# Altium schematic sheet Expanders.SchDoc
size A2
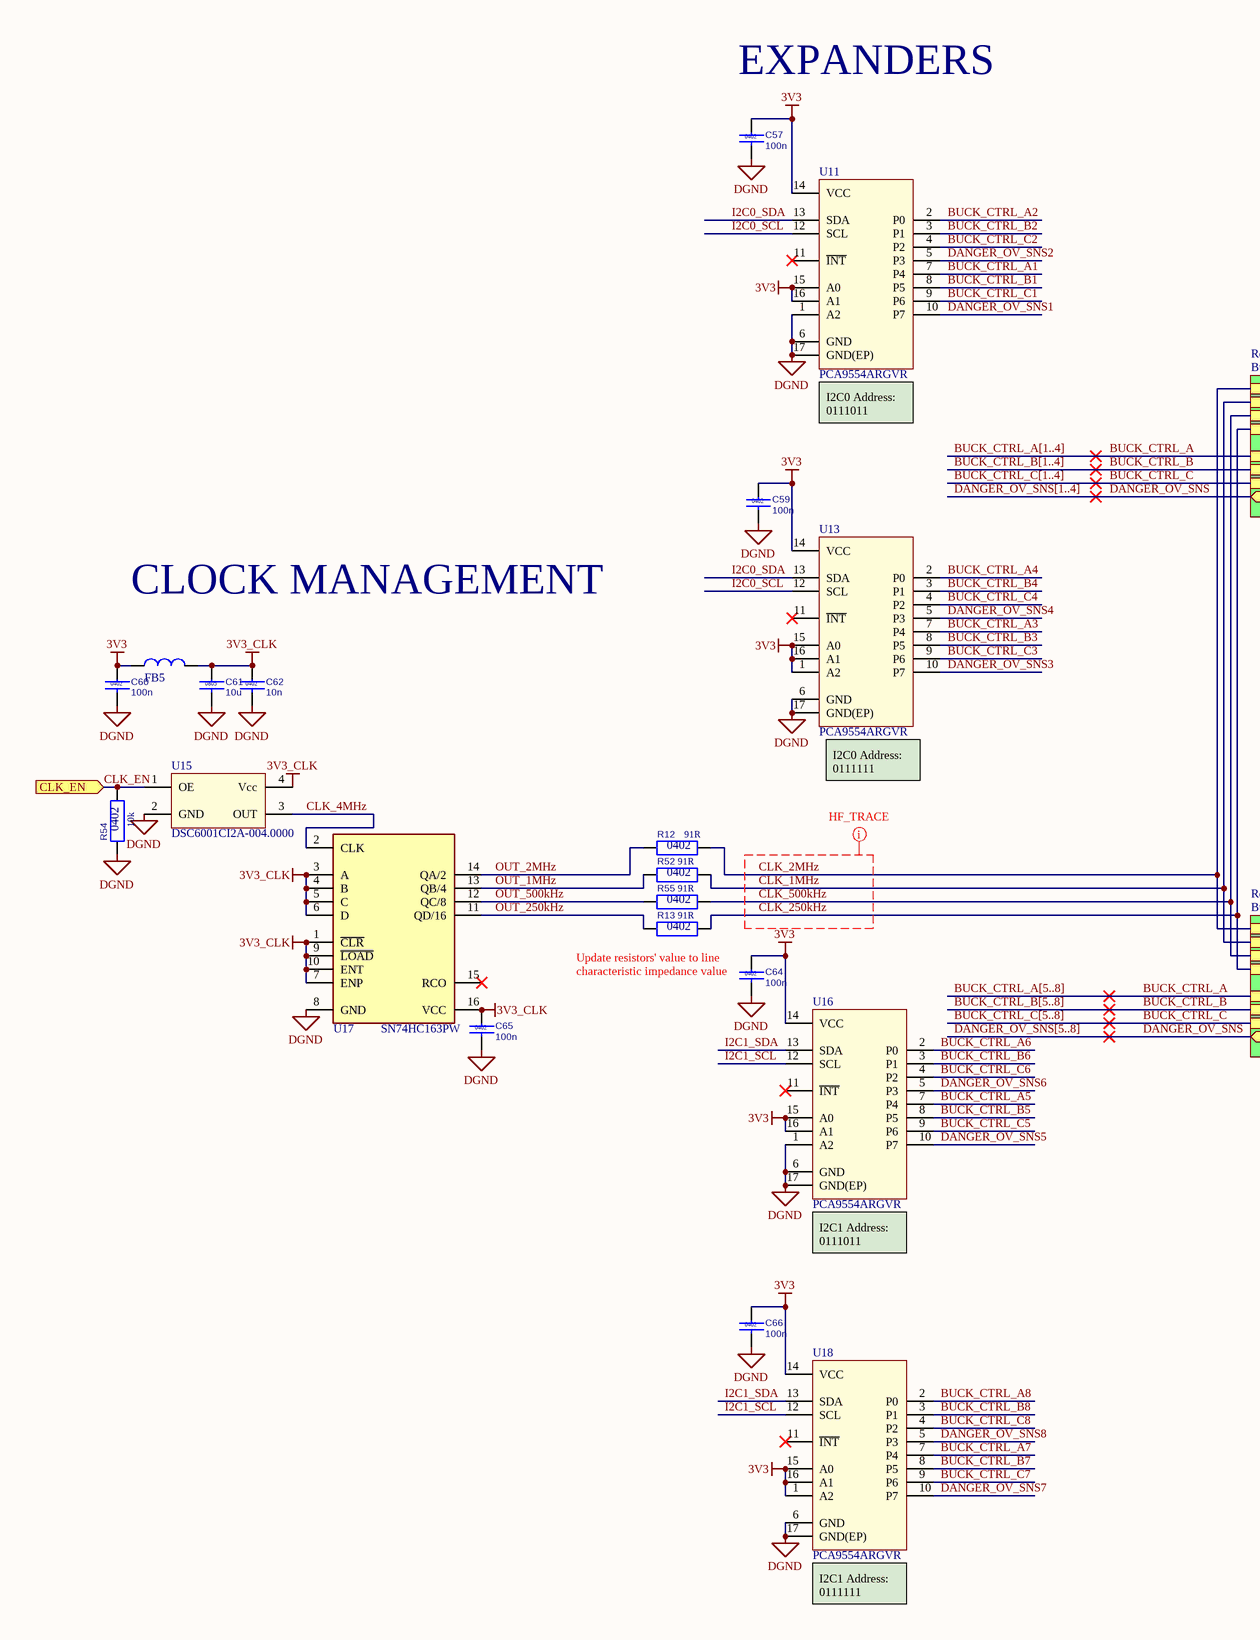
[diagram p0: Expanders.SchDoc, left]
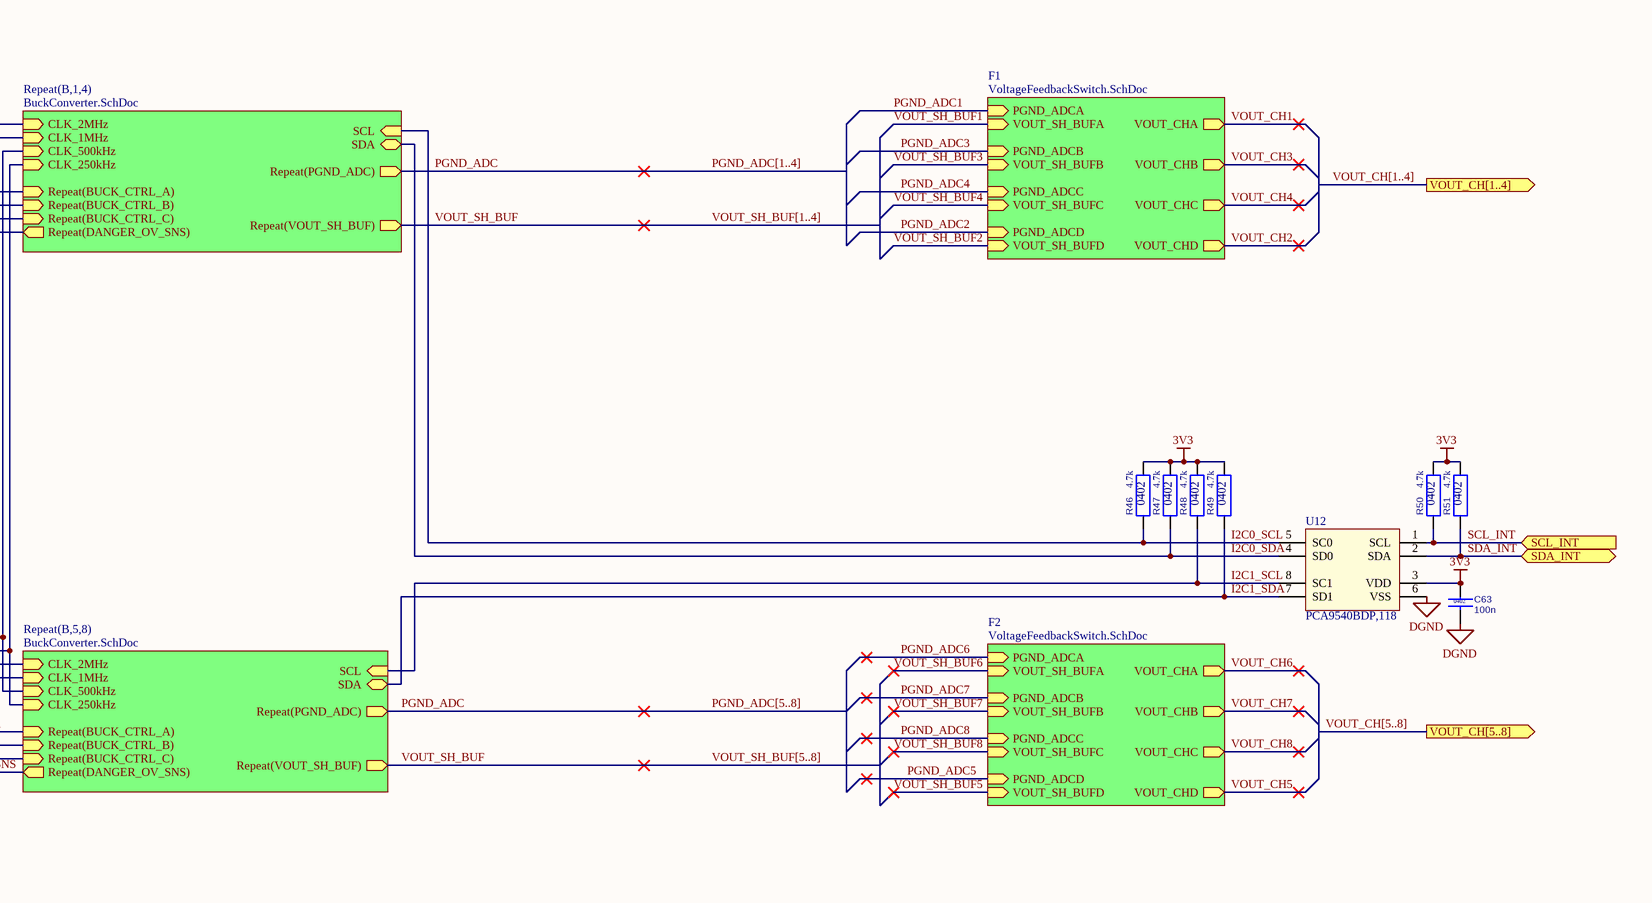
[diagram p1: Expanders.SchDoc, right]

## Parts
C57  100n  Case: 0402  [CC0402M]
C59  100n  Case: 0402  [CC0402M]
C60  100n  Case: 0402  [CC0402M]
C61  10u  Case: 0805  [CC0805M]
C62  10n  Case: 0402  [CC0402M]
C63  100n  Case: 0402  [CC0402M]
C64  100n  Case: 0402  [CC0402M]
C65  100n  Case: 0402  [CC0402M]
C66  100n  Case: 0402  [CC0402M]
FB5  BLM18HG102SN1D  [FB0603M]  (value not drawn)
R12  Case: 0402  [RC0402M]  (hidden comment: 91R)
R13  Case: 0402  [RC0402M]  (hidden comment: 91R)
R46  Case: 0402  [RC0402M]  (hidden comment: 4.7k)
R47  Case: 0402  [RC0402M]  (hidden comment: 4.7k)
R48  Case: 0402  [RC0402M]  (hidden comment: 4.7k)
R49  Case: 0402  [RC0402M]  (hidden comment: 4.7k)
R50  Case: 0402  [RC0402M]  (hidden comment: 4.7k)
R51  Case: 0402  [RC0402M]  (hidden comment: 4.7k)
R52  Case: 0402  [RC0402M]  (hidden comment: 91R)
R54  Case: 0402  [RC0402M]  (hidden comment: 10k)
R55  Case: 0402  [RC0402M]  (hidden comment: 91R)
U11  PCA9554ARGVR  [VQFN-16(RGV)]
U12  PCA9540BDP,118  [TSSOP-8]
U13  PCA9554ARGVR  [VQFN-16(RGV)]
U15  DSC6001CI2A-004.0000  [CDFN3225-4LD]
U16  PCA9554ARGVR  [VQFN-16(RGV)]
U17  SN74HC163PW  [TSSOP-16]
U18  PCA9554ARGVR  [VQFN-16(RGV)]

## Sub-sheets
F1 = VoltageFeedbackSwitch.SchDoc: PGND_ADCD (in), VOUT_SH_BUFD (in), PGND_ADCB (in), VOUT_SH_BUFB (in), VOUT_CHD (out), VOUT_SH_BUFC (in), PGND_ADCC (in), VOUT_CHA (out), PGND_ADCA (in), VOUT_SH_BUFA (in), VOUT_CHC (out), VOUT_CHB (out)
F2 = VoltageFeedbackSwitch.SchDoc: PGND_ADCD (in), VOUT_SH_BUFD (in), PGND_ADCB (in), VOUT_SH_BUFB (in), VOUT_CHD (out), VOUT_SH_BUFC (in), PGND_ADCC (in), VOUT_CHA (out), PGND_ADCA (in), VOUT_SH_BUFA (in), VOUT_CHC (out), VOUT_CHB (out)
Repeat(B,1,4) = BuckConverter.SchDoc: CLK_1MHz (in), SDA (bidir), SCL (in), CLK_500kHz (in), Repeat(BUCK_CTRL_C) (in), Repeat(BUCK_CTRL_B) (in), Repeat(BUCK_CTRL_A) (in), Repeat(DANGER_OV_SNS) (out), Repeat(PGND_ADC) (out), Repeat(VOUT_SH_BUF) (out), CLK_250kHz (in), CLK_2MHz (in)
Repeat(B,5,8) = BuckConverter.SchDoc: CLK_1MHz (in), SDA (bidir), SCL (in), CLK_500kHz (in), Repeat(BUCK_CTRL_C) (in), Repeat(BUCK_CTRL_B) (in), Repeat(BUCK_CTRL_A) (in), Repeat(DANGER_OV_SNS) (out), Repeat(PGND_ADC) (out), Repeat(VOUT_SH_BUF) (out), CLK_250kHz (in), CLK_2MHz (in)

## Ports
CLK_EN (in), SCL_INT (in), SDA_INT (bidir), VOUT_CH[1..4] (out), VOUT_CH[5..8] (out)

## Nets
3V3: C57.1 C59.1 C60.1 C63.1 C64.1 C66.1 FB5.1 R46.2 R47.2 R48.2 R49.2 R50.2 R51.2 U11.14(VCC) U11.15(A0) U11.16(A1) U12.3(VDD) U13.1(A2) U13.14(VCC) U13.15(A0) U13.16(A1) U16.14(VCC) U16.15(A0) U16.16(A1) U18.1(A2) U18.14(VCC) U18.15(A0) U18.16(A1)
3V3_CLK: C61.1 C62.1 C65.1 FB5.2 U15.4(Vcc) U17.1(~{CLR}) U17.3(A) U17.4(B) U17.5(C) U17.6(D) U17.7(ENP) U17.9(~{LOAD}) U17.10(ENT) U17.16(VCC)
DGND: C57.2 C59.2 C60.2 C61.2 C62.2 C63.2 C64.2 C65.2 C66.2 R54.1 U11.1(A2) U11.6(GND) U11.17(GND(EP)) U12.6(VSS) U13.6(GND) U13.17(GND(EP)) U15.2(GND) U16.1(A2) U16.6(GND) U16.17(GND(EP)) U17.8(GND) U18.6(GND) U18.17(GND(EP))
BUCK_CTRL_A: sheet Repeat(B,1,4)/Repeat(BUCK_CTRL_A), sheet Repeat(B,5,8)/Repeat(BUCK_CTRL_A)
BUCK_CTRL_A1: U11.7(P4)
BUCK_CTRL_A2: U11.2(P0)
BUCK_CTRL_A3: U13.7(P4)
BUCK_CTRL_A4: U13.2(P0)
BUCK_CTRL_A5: U16.7(P4)
BUCK_CTRL_A6: U16.2(P0)
BUCK_CTRL_A7: U18.7(P4)
BUCK_CTRL_A8: U18.2(P0)
BUCK_CTRL_B: sheet Repeat(B,1,4)/Repeat(BUCK_CTRL_B), sheet Repeat(B,5,8)/Repeat(BUCK_CTRL_B)
BUCK_CTRL_B1: U11.8(P5)
BUCK_CTRL_B2: U11.3(P1)
BUCK_CTRL_B3: U13.8(P5)
BUCK_CTRL_B4: U13.3(P1)
BUCK_CTRL_B5: U16.8(P5)
BUCK_CTRL_B6: U16.3(P1)
BUCK_CTRL_B7: U18.8(P5)
BUCK_CTRL_B8: U18.3(P1)
BUCK_CTRL_C: sheet Repeat(B,1,4)/Repeat(BUCK_CTRL_C), sheet Repeat(B,5,8)/Repeat(BUCK_CTRL_C)
BUCK_CTRL_C1: U11.9(P6)
BUCK_CTRL_C2: U11.4(P2)
BUCK_CTRL_C3: U13.9(P6)
BUCK_CTRL_C4: U13.4(P2)
BUCK_CTRL_C5: U16.9(P6)
BUCK_CTRL_C6: U16.4(P2)
BUCK_CTRL_C7: U18.9(P6)
BUCK_CTRL_C8: U18.4(P2)
CLK_1MHz: R52.2 ; sheet Repeat(B,1,4)/CLK_1MHz, sheet Repeat(B,5,8)/CLK_1MHz
CLK_2MHz: R12.2 ; sheet Repeat(B,1,4)/CLK_2MHz, sheet Repeat(B,5,8)/CLK_2MHz
CLK_4MHz: U15.3(OUT) U17.2(CLK)
CLK_250kHz: R13.2 ; sheet Repeat(B,1,4)/CLK_250kHz, sheet Repeat(B,5,8)/CLK_250kHz
CLK_500kHz: R55.2 ; sheet Repeat(B,1,4)/CLK_500kHz, sheet Repeat(B,5,8)/CLK_500kHz
CLK_EN: R54.2 U15.1(OE) ; port CLK_EN
DANGER_OV_SNS: sheet Repeat(B,1,4)/Repeat(DANGER_OV_SNS), sheet Repeat(B,5,8)/Repeat(DANGER_OV_SNS)
DANGER_OV_SNS1: U11.10(P7)
DANGER_OV_SNS2: U11.5(P3)
DANGER_OV_SNS3: U13.10(P7)
DANGER_OV_SNS4: U13.5(P3)
DANGER_OV_SNS5: U16.10(P7)
DANGER_OV_SNS6: U16.5(P3)
DANGER_OV_SNS7: U18.10(P7)
DANGER_OV_SNS8: U18.5(P3)
I2C0_SCL: R46.1 U11.12(SCL) U12.5(SC0) U13.12(SCL) ; sheet Repeat(B,1,4)/SCL
I2C0_SDA: R47.1 U11.13(SDA) U12.4(SD0) U13.13(SDA) ; sheet Repeat(B,1,4)/SDA
I2C1_SCL: R48.1 U12.8(SC1) U16.12(SCL) U18.12(SCL) ; sheet Repeat(B,5,8)/SCL
I2C1_SDA: R49.1 U12.7(SD1) U16.13(SDA) U18.13(SDA) ; sheet Repeat(B,5,8)/SDA
OUT_1MHz: R52.1 U17.13(QB/4)
OUT_2MHz: R12.1 U17.14(QA/2)
OUT_250kHz: R13.1 U17.11(QD/16)
OUT_500kHz: R55.1 U17.12(QC/8)
PGND_ADC: sheet Repeat(B,1,4)/Repeat(PGND_ADC), sheet Repeat(B,5,8)/Repeat(PGND_ADC)
PGND_ADC1: sheet F1/PGND_ADCA
PGND_ADC2: sheet F1/PGND_ADCD
PGND_ADC3: sheet F1/PGND_ADCB
PGND_ADC4: sheet F1/PGND_ADCC
PGND_ADC5: sheet F2/PGND_ADCD
PGND_ADC6: sheet F2/PGND_ADCA
PGND_ADC7: sheet F2/PGND_ADCB
PGND_ADC8: sheet F2/PGND_ADCC
SCL_INT: R50.1 U12.1(SCL) ; port SCL_INT
SDA_INT: R51.1 U12.2(SDA) ; port SDA_INT
VOUT_CH1: sheet F1/VOUT_CHA
VOUT_CH2: sheet F1/VOUT_CHD
VOUT_CH3: sheet F1/VOUT_CHB
VOUT_CH4: sheet F1/VOUT_CHC
VOUT_CH5: sheet F2/VOUT_CHD
VOUT_CH6: sheet F2/VOUT_CHA
VOUT_CH7: sheet F2/VOUT_CHB
VOUT_CH8: sheet F2/VOUT_CHC
VOUT_SH_BUF: sheet Repeat(B,1,4)/Repeat(VOUT_SH_BUF), sheet Repeat(B,5,8)/Repeat(VOUT_SH_BUF)
VOUT_SH_BUF1: sheet F1/VOUT_SH_BUFA
VOUT_SH_BUF2: sheet F1/VOUT_SH_BUFD
VOUT_SH_BUF3: sheet F1/VOUT_SH_BUFB
VOUT_SH_BUF4: sheet F1/VOUT_SH_BUFC
VOUT_SH_BUF5: sheet F2/VOUT_SH_BUFD
VOUT_SH_BUF6: sheet F2/VOUT_SH_BUFA
VOUT_SH_BUF7: sheet F2/VOUT_SH_BUFB
VOUT_SH_BUF8: sheet F2/VOUT_SH_BUFC

Not connected (* = marked no-connect by the designer): U11 11(~{INT})*; U13 11(~{INT})*; U16 11(~{INT})*; U17 15(RCO)*; U18 11(~{INT})*

## Buses and harness runs
bus BUCK_CTRL_A[1..4]
bus BUCK_CTRL_A[5..8]
bus BUCK_CTRL_B[1..4]
bus BUCK_CTRL_B[5..8]
bus BUCK_CTRL_C[1..4]
bus BUCK_CTRL_C[5..8]
bus DANGER_OV_SNS[1..4]
bus DANGER_OV_SNS[5..8]
bus PGND_ADC[1..4]
bus PGND_ADC[5..8]
bus VOUT_CH[1..4] = port VOUT_CH[1..4]
bus VOUT_CH[5..8] = port VOUT_CH[5..8]
bus VOUT_SH_BUF[1..4]
bus VOUT_SH_BUF[5..8]

## Layout directives
net class HF_TRACE: CLK_1MHz, CLK_2MHz, CLK_250kHz, CLK_500kHz

## Notes on the sheet
- (near C57) EXPANDERS
- (near U11) I2C0 Address:
  0111011
- CLOCK MANAGEMENT
- (near U13) I2C0 Address:
  0111111
- Update resistors' value to line characteristic impedance value
- (near U16) I2C1 Address:
  0111011
- (near U18) I2C1 Address:
  0111111

## Library data of the parts
C57 C59 C60 C63-C66 = CC0402K-X7R-25V-100N-M: Chip ceramic capacitor; Manufacturer PN: GRM155R71E104KE14J; Manufacturer: Murata; Tollerance: 10%; Rated Voltage: 25V; Material: X7R; PartNumber: CC0402K-X7R-25V-100N-M; Value: 100n; Publisher: alexey.savchenko; Publishing Date: 1/12/2020
C61 = CC0805K-X7R-6V3-10U-M: Chip ceramic capacitor; Manufacturer PN: CL21B106KQQNNNG; Manufacturer: Samsung; Tollerance: 10%; Rated Voltage: 6.3V; Material: X7R; PartNumber: CC0805K-X7R-6V3-10U-M; Value: 10u; Publisher: alexey.savchenko; Publishing Date: 2/17/2020
C62 = CC0402K-X7R-50V-10N-M: Chip ceramic capacitor; Manufacturer PN: CC0402KRX7R9BB103; Manufacturer: Yageo; Tollerance: 10%; Rated Voltage: 50V; Material: X7R; PartNumber: CC0402K-X7R-50V-10N-M; Value: 10n; Publisher: alexey.savchenko; Publishing Date: 2/27/2020
FB5 = BLM18HG102SN1D: FERRITE BEAD 1 KOHM 0603 1LN; Manufacturer: Murata; Resistance: 1000; PartNumber: BLM18HG102SN1D; Manufacturer PN: BLM18HG102SN1D; Publisher: alexey.savchenko; Publishing Date: 1/12/2020
R12 R13 R52 R55 = RC0402F-91R-M: Chip resistor; Manufacturer PN: RC0402FR-0791RL; Manufacturer: Yageo; Tollerance: 1%; Rated Voltage: 50V; Power: 0.063W; Value: 91R; PartNumber: RC0402F-91R-M; Publisher: alexey.savchenko; Publishing Date: 2/24/2020
R46-R51 = RC0402F-4K7-M: Chip resistor; Manufacturer PN: RC0402FR-074K7L; Manufacturer: Yageo; Tollerance: 1%; Rated Voltage: 50V; Power: 0.063W; T Coefficient: 100ppm; Value: 4.7k; PartNumber: RC0402F-4K7-M; Publisher: alexey.savchenko; Publishing Date: 2/24/2020
R54 = RC0402F-10K-M: Chip resistor; Manufacturer PN: RC0402FR-0710KL; Manufacturer: Yageo; Tollerance: 1%; Rated Voltage: 50V; Power: 0.063W; T Coefficient: 100ppm; Value: 10k; PartNumber: RC0402F-10K-M; Publisher: alexey.savchenko; Publishing Date: 2/24/2020
U11 U13 U16 U18 = PCA9554ARGVR: I/O Expander 8 I²C, SMBus 400kHz 16-VQFN (4x4); Manufacturer: TI; Analogs: NXP has same chip; PartNumber: PCA9554ARGVR; Manufacturer PN: PCA9554ARGVR; Case: VQFN-16(RGV); Publisher: alexey.savchenko; Publishing Date: 2/26/2020
U12 = PCA9540BDP,118: IC INTERFACE SPECIALIZED 8TSSOP; Manufacturer: NXP; PartNumber: PCA9540BDP,118; Manufacturer PN: PCA9540BDP,118; Case: TSSOP-8; Publisher: alexey.savchenko; Publishing Date: 1/24/2020
U15 = DSC6001CI2A-004.0000: 4MHz XO (Standard) CMOS Oscillator 1.8V ~ 3.3V Enable/Disable 4-SMD, No Lead; Manufacturer: Microchip; PartNumber: DSC6001CI2A-004.0000; Manufacturer PN: DSC6001CI2A-004.0000; Frequency: 4MHz; Publisher: alexey.savchenko; Publishing Date: 3/6/2020
U17 = SN74HC163PW: Counter IC Binary Counter 1 Element 4 Bit Positive Edge 16-TSSOP; Manufacturer: TI; PartNumber: SN74HC163PW; Manufacturer PN: SN74HC163PW; Case: TSSOP-16; Publisher: alexey.savchenko; Publishing Date: 3/6/2020